# EAGLE design M623 (EAGLE 6.6.0)
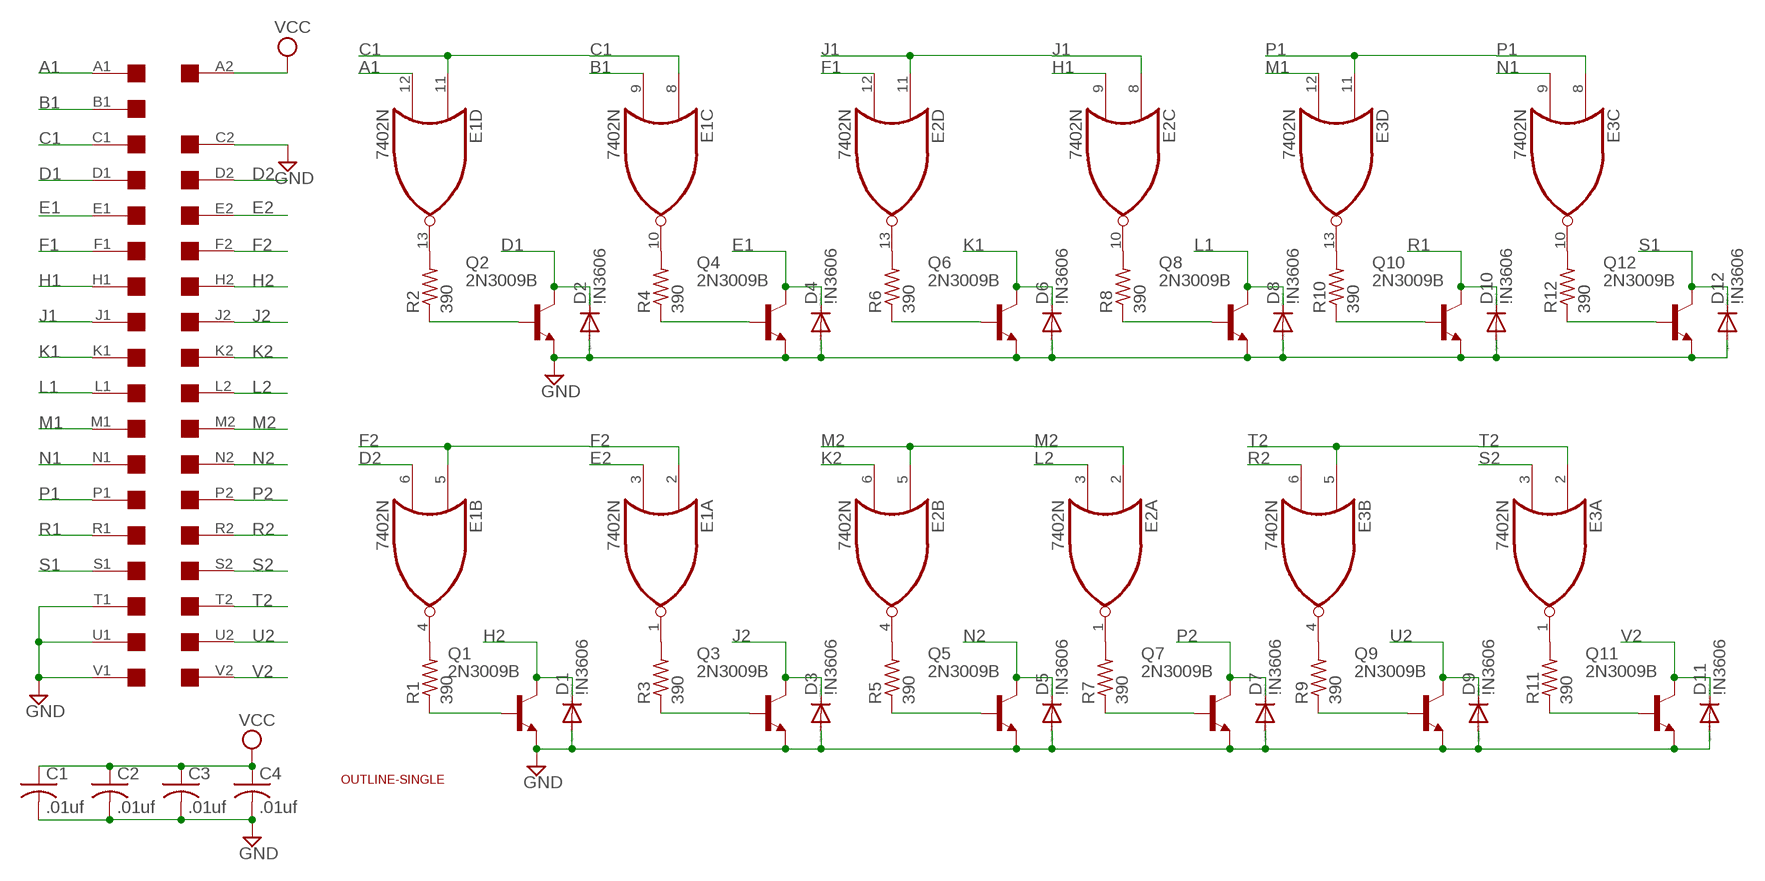
[diagram p0: schematic, sheet 1]

## Parts
C1  .01uf  C-US050-025X075  [C050-025X075]
C2  .01uf  C-US050-025X075  [C050-025X075]
C3  .01uf  C-US050-025X075  [C050-025X075]
C4  .01uf  C-US050-025X075  [C050-025X075]
D1  \!N3606  1N4148DO35-10  [DO35-10]
D2  \!N3606  1N4148DO35-10  [DO35-10]
D3  \!N3606  1N4148DO35-10  [DO35-10]
D4  \!N3606  1N4148DO35-10  [DO35-10]
D5  \!N3606  1N4148DO35-10  [DO35-10]
D6  \!N3606  1N4148DO35-10  [DO35-10]
D7  \!N3606  1N4148DO35-10  [DO35-10]
D8  \!N3606  1N4148DO35-10  [DO35-10]
D9  \!N3606  1N4148DO35-10  [DO35-10]
D10  \!N3606  1N4148DO35-10  [DO35-10]
D11  \!N3606  1N4148DO35-10  [DO35-10]
D12  \!N3606  1N4148DO35-10  [DO35-10]
E1  7402N  [DIL14]
E2  7402N  [DIL14]
E3  7402N  [DIL14]
Q1  2N3009B  2N1613-NPN-TO39-EBC  [TO39]
Q2  2N3009B  2N1613-NPN-TO39-EBC  [TO39]
Q3  2N3009B  2N1613-NPN-TO39-EBC  [TO39]
Q4  2N3009B  2N1613-NPN-TO39-EBC  [TO39]
Q5  2N3009B  2N1613-NPN-TO39-EBC  [TO39]
Q6  2N3009B  2N1613-NPN-TO39-EBC  [TO39]
Q7  2N3009B  2N1613-NPN-TO39-EBC  [TO39]
Q8  2N3009B  2N1613-NPN-TO39-EBC  [TO39]
Q9  2N3009B  2N1613-NPN-TO39-EBC  [TO39]
Q10  2N3009B  2N1613-NPN-TO39-EBC  [TO39]
Q11  2N3009B  2N1613-NPN-TO39-EBC  [TO39]
Q12  2N3009B  2N1613-NPN-TO39-EBC  [TO39]
R1  390  R-US_0207/10  [0207/10]
R2  390  R-US_0207/10  [0207/10]
R3  390  R-US_0207/10  [0207/10]
R4  390  R-US_0207/10  [0207/10]
R5  390  R-US_0207/10  [0207/10]
R6  390  R-US_0207/10  [0207/10]
R7  390  R-US_0207/10  [0207/10]
R8  390  R-US_0207/10  [0207/10]
R9  390  R-US_0207/10  [0207/10]
R10  390  R-US_0207/10  [0207/10]
R11  390  R-US_0207/10  [0207/10]
R12  390  R-US_0207/10  [0207/10]
U$1  OUTLINE-SINGLE  [SINGLE]
U$4  SINGLE  [EDGE-CON2]

## Nets
A1: E1.12(D:I1) U$4.A1
B1: E1.9(C:I1) U$4.B1
C1: E1.8(C:I0) E1.11(D:I0) U$4.C1
D1: D2.C Q2.3(C) U$4.D1
D2: E1.6(B:I1) U$4.D2
E1: D4.C Q4.3(C) U$4.E1
E2: E1.3(A:I1) U$4.E2
F1: E2.12(D:I1) U$4.F1
F2: E1.2(A:I0) E1.5(B:I0) U$4.F2
GND: C1.2 C2.2 C3.2 C4.2 D1.A D2.A D3.A D4.A D5.A D6.A D7.A D8.A D9.A D10.A D11.A D12.A Q1.1(E) Q2.1(E) Q3.1(E) Q4.1(E) Q5.1(E) Q6.1(E) Q7.1(E) Q8.1(E) Q9.1(E) Q10.1(E) Q11.1(E) Q12.1(E) U$4.C2 U$4.T1 U$4.U1 U$4.V1
H1: E2.9(C:I1) U$4.H1
H2: D1.C Q1.3(C) U$4.H2
J1: E2.8(C:I0) E2.11(D:I0) U$4.J1
J2: D3.C Q3.3(C) U$4.J2
K1: D6.C Q6.3(C) U$4.K1
K2: E2.6(B:I1) U$4.K2
L1: D8.C Q8.3(C) U$4.L1
L2: E2.3(A:I1) U$4.L2
M1: E3.12(D:I1) U$4.M1
M2: E2.2(A:I0) E2.5(B:I0) U$4.M2
N1: E3.9(C:I1) U$4.N1
N2: D5.C Q5.3(C) U$4.N2
N$1: E1.13(D:O) R2.2
N$2: Q2.2(B) R2.1
N$3: E1.4(B:O) R1.2
N$4: Q1.2(B) R1.1
N$12: E1.10(C:O) R4.2
N$13: E1.1(A:O) R3.2
N$14: E2.4(B:O) R5.2
N$15: E2.13(D:O) R6.2
N$16: E2.1(A:O) R7.2
N$17: E2.10(C:O) R8.2
N$18: E3.4(B:O) R9.2
N$19: E3.13(D:O) R10.2
N$20: E3.1(A:O) R11.2
N$21: E3.10(C:O) R12.2
N$22: Q12.2(B) R12.1
N$24: Q4.2(B) R4.1
N$25: Q6.2(B) R6.1
N$26: Q8.2(B) R8.1
N$27: Q10.2(B) R10.1
N$28: Q3.2(B) R3.1
N$29: Q5.2(B) R5.1
N$30: Q7.2(B) R7.1
N$31: Q9.2(B) R9.1
N$32: Q11.2(B) R11.1
P1: E3.8(C:I0) E3.11(D:I0) U$4.P1
P2: D7.C Q7.3(C) U$4.P2
R1: D10.C Q10.3(C) U$4.R1
R2: E3.6(B:I1) U$4.R2
S1: D12.C Q12.3(C) U$4.S1
S2: E3.3(A:I1) U$4.S2
T2: E3.2(A:I0) E3.5(B:I0) U$4.T2
U2: D9.C Q9.3(C) U$4.U2
V2: D11.C Q11.3(C) U$4.V2
VCC: C1.1 C2.1 C3.1 C4.1 U$4.A2
Unconnected: U$4.B2

## Power pins joined to a net without a drawn wire
GND: E1.7(P:GND) E2.7(P:GND) E3.7(P:GND)
VCC: E1.14(P:VCC) E2.14(P:VCC) E3.14(P:VCC)

## Library data of the parts
C1-C4 = rcl:C-US: CAPACITOR, American symbol
D1-D12 = diode:1N4148: DIODE high speed (Philips)
E1-E3 = 74xx-us:74*02: Quad 2-input NOR gate
Q1-Q12 = transistor:*-NPN-: NPN Transistror BF959 corrected 2008.03.06
R1-R12 = rcl:R-US_: RESISTOR, American symbol
U$1 = dec-con:OUTLINE-*: Board outlines for DEC boards.
U$4 = dec-con:SINGLE: Single-Height DEC board

## Board
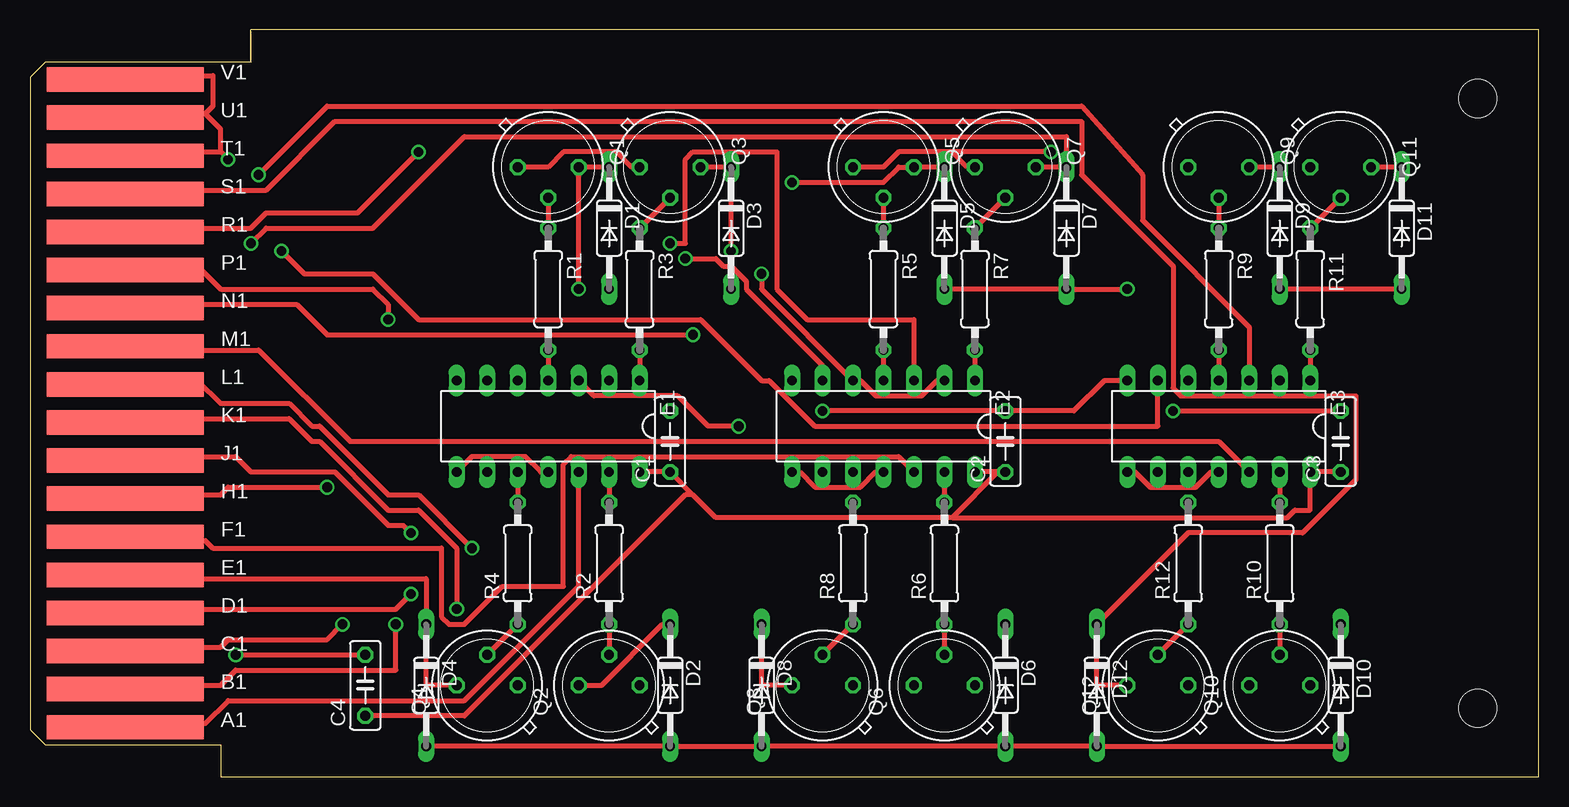
[diagram p1: board, top side]
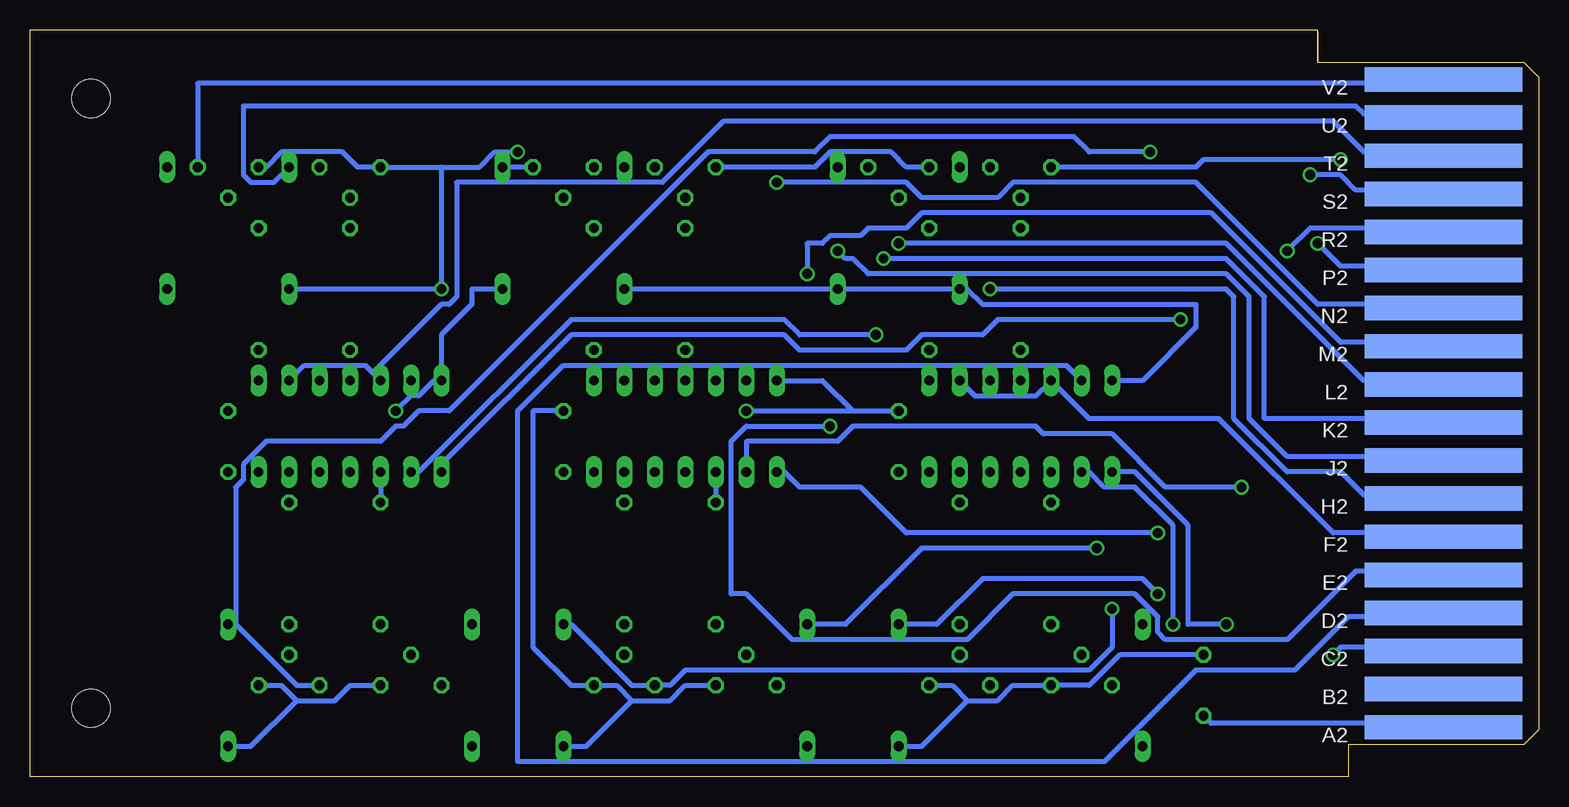
[diagram p2: board, bottom side, seen from below]

Size 125.73 x 62.23 mm. Coordinates in mm from the lower left corner, seen from the top.
Copper layers (1+16): Top 0.035mm / dielectric 1.5mm / Bottom 0.035mm
Design rules "16mils": minimum track width 16mil, minimum drill 32mil, track to track 15mil, track to pad 10mil, pad to pad 10mil, via to via 10mil, smd to smd 10mil, copper to edge 13mil, drill to drill 10mil, minimum pad ring 10mil, minimum via ring 8mil, stop-mask expansion 0mil, vias tented up to drill 0mil, thermal gap 10mil

### Footprints (pad centres in the part's own frame; a part is rotated, then mirrored left to right if it is on the bottom)
C050-025X075 = drill 0.813 octagon: 1 -2.54,0; 2 2.54,0
DO35-10 = drill 0.813 long: A 5.08,0; C -5.08,0
DIL14 = drill 0.813 long: 1 -7.62,-3.81; 2 -5.08,-3.81; 3 -2.54,-3.81; 4 0,-3.81; 5 2.54,-3.81; 6 5.08,-3.81; 7 7.62,-3.81; 8 7.62,3.81; 9 5.08,3.81; 10 2.54,3.81; 11 0,3.81; 12 -2.54,3.81; 13 -5.08,3.81; 14 -7.62,3.81
TO39 = drill 0.813 octagon: 1 0,-2.54; 2 2.54,0; 3 0,2.54
0207/10 = drill 0.813 octagon: 1 -5.08,0; 2 5.08,0
SINGLE = hole 3.175: 120.65,56.515; 120.65,5.715
EDGE-CON2 = smd 13.106 x 2.032: A1 7.938,4.128; B1 7.938,7.303; C1 7.938,10.477; D1 7.938,13.652; E1 7.938,16.828; F1 7.938,20.003; H1 7.938,23.177; J1 7.938,26.352; K1 7.938,29.527; L1 7.938,32.703; M1 7.938,35.877; N1 7.938,39.053; P1 7.938,42.227; R1 7.938,45.403; S1 7.938,48.578; T1 7.938,51.752; U1 7.938,54.928; V1 7.938,58.102 | smd 13.106 x 2.032 bottom: A2 7.938,4.128; B2 7.938,7.303; C2 7.938,10.477; D2 7.938,13.652; E2 7.938,16.828; F2 7.938,20.003; H2 7.938,23.177; J2 7.938,26.352; K2 7.938,29.527; L2 7.938,32.703; M2 7.938,35.877; N2 7.938,39.053; P2 7.938,42.227; R2 7.938,45.403; S2 7.938,48.578; T2 7.938,51.752; U2 7.938,54.928; V2 7.938,58.102

### Placement (x,y rotation side)
C1  53.34,27.94 90 top
C2  81.28,27.94 90 top
C3  109.22,27.94 90 top
C4  27.94,7.62 90 top
D1  48.26,45.72 270 top
D2  53.34,7.62 270 top
D3  58.42,45.72 270 top
D4  33.02,7.62 270 top
D5  76.2,45.72 270 top
D6  81.28,7.62 270 top
D7  86.36,45.72 270 top
D8  60.96,7.62 270 top
D9  104.14,45.72 270 top
D10  109.22,7.62 270 top
D11  114.3,45.72 270 top
D12  88.9,7.62 270 top
E1  43.18,29.21 180 top
E2  71.12,29.21 180 top
E3  99.06,29.21 180 top
Q1  43.18,50.8 270 top
Q2  48.26,7.62 90 top
Q3  53.34,50.8 270 top
Q4  38.1,7.62 90 top
Q5  71.12,50.8 270 top
Q6  76.2,7.62 90 top
Q7  81.28,50.8 270 top
Q8  66.04,7.62 90 top
Q9  99.06,50.8 270 top
Q10  104.14,7.62 90 top
Q11  109.22,50.8 270 top
Q12  93.98,7.62 90 top
R1  43.18,40.64 270 top
R2  48.26,17.78 90 top
R3  50.8,40.64 270 top
R4  40.64,17.78 90 top
R5  71.12,40.64 270 top
R6  76.2,17.78 90 top
R7  78.74,40.64 270 top
R8  68.58,17.78 90 top
R9  99.06,40.64 270 top
R10  104.14,17.78 90 top
R11  106.68,40.64 270 top
R12  96.52,17.78 90 top
U$1  0,0 0 top
U$4  0,0 0 top

### Tracks (layer width: path | path; a pad name or v marks a point on that pad's centre or on a via)
A1
  Top 0.406: E1.12 45.72,15.88 36.2,6.35 16.51,6.35 14.61,4.45 8.26,4.45 U$4.A1
B1  (via drill 0.81)
  Top 0.406: v30.48,12.7 30.48,8.89 17.15,8.89 15.88,7.62 8.26,7.62 U$4.B1
  Bottom 0.406: E1.9 37.47,25.4 36.2,24.13 33.66,24.13 30.48,20.95 v30.48,12.7
C1  (via drill 0.81)
  Top 0.406: E1.8 36.83,26.67 41.28,26.67 42.55,25.4 E1.11 | v26.04,12.7 24.77,11.43 16.51,11.43 15.88,10.79 8.26,10.79 U$4.C1
  Bottom 0.406: E1.8 33.66,25.4 29.21,20.95 29.21,12.7 v26.04,12.7
D1  (via drill 0.81)
  Top 0.406: D2.C 52.71,12.7 47.63,7.62 Q2.3 | v31.75,15.24 30.48,13.97 8.26,13.97 U$4.D1
  Bottom 0.406: D2.C 50.17,12.7 46.36,16.51 33.02,16.51 v31.75,15.24
D2
  Bottom 0.406: E1.6 39.37,34.29 81.28,34.29 85.09,30.48 85.09,1.27 36.2,1.27 28.58,8.89 20.32,8.89 15.88,13.34 8.26,13.34 U$4.D2
E1
  Top 0.406: Q4.3 33.02,7.62 D4.C 33.02,16.51 8.26,16.51 U$4.E1
E2  (via drill 0.81)
  Top 0.406: E1.3 46.99,31.75 53.98,31.75 56.52,29.21 v59.06,29.21
  Bottom 0.406: v59.06,29.21 66.04,29.21 67.31,27.94 67.31,15.24 66.04,15.24 62.23,11.43 47.63,11.43 43.82,15.24 33.66,15.24 31.75,13.34 31.75,12.06 31.12,11.43 20.96,11.43 15.24,17.14 8.26,17.14 U$4.E2
F1
  Top 0.406: E2.12 72.39,26.67 45.09,26.67 44.45,26.04 44.45,15.88 39.37,15.88 36.2,12.7 34.93,12.7 34.29,13.34 34.29,19.05 15.24,19.05 14.61,19.68 8.26,19.68 U$4.F1
F2
  Bottom 0.406: E1.2 46.99,31.75 41.91,31.75 E1.5 37.47,29.84 26.67,29.84 17.15,20.32 8.26,20.32 U$4.F2
GND  (via drill 0.81)
  Top 0.406: v17.15,10.16 C4.2 | D4.A D2.A D8.A D6.A D12.A D10.A | E3.7 89.54,33.02 87,30.48 C2.2 v66.04,30.48 | v95.25,30.48 C3.2 | D11.A D9.A | D5.A D7.A v91.44,40.64 | Q5.1 71.12,50.8 72.39,52.07 76.84,52.07 | 76.84,52.07 78.11,50.8 Q7.1 | v85.09,52.07 76.84,52.07 | 14.61,55.24 8.26,55.24 U$4.U1 | 14.61,55.24 15.24,55.88 15.24,58.42 8.26,58.42 U$4.V1 | Q1.1 43.18,50.8 44.45,52.07 48.9,52.07 50.17,50.8 Q3.1 | 15.88,52.07 v16.51,51.44 | 15.88,52.07 8.26,52.07 U$4.T1 | 14.61,55.24 15.88,53.98 15.88,52.07
  Bottom 0.406: 47.63,6.35 45.09,6.35 43.82,7.62 Q4.1 37.47,7.62 34.93,10.16 C4.2 | 47.63,6.35 48.9,7.62 Q2.1 | v17.15,10.16 16.51,10.79 8.26,10.79 U$4.C2 | Q12.1 99.06,7.62 100.33,6.35 103.51,6.35 | 103.51,6.35 104.78,7.62 Q10.1 | Q8.1 71.12,7.62 72.39,6.35 75.57,6.35 | 75.57,6.35 76.84,7.62 Q6.1 80.65,7.62 83.82,10.79 83.82,30.48 C2.2 | 75.57,6.35 79.38,2.54 D6.A | 103.51,6.35 107.32,2.54 D10.A | 47.63,6.35 51.44,2.54 D2.A | 57.15,30.48 C1.2 | 57.15,30.48 59.69,33.02 E2.7 | v95.25,30.48 93.98,31.75 93.35,31.75 92.08,33.02 E3.7 91.44,36.83 88.9,39.37 88.9,40.64 D7.A | v66.04,30.48 57.15,30.48 | E1.7 33.02,33.02 28.58,37.47 28.58,39.37 46.36,39.37 47.63,40.64 D1.A D3.A D5.A | D9.A v91.44,40.64 91.44,50.8 | Q11.1 106.05,50.8 104.78,52.07 99.7,52.07 98.43,50.8 Q9.1 91.44,50.8 | v85.09,52.07 87,52.07 88.27,50.8 91.44,50.8 | Q1.1 28.58,50.8 27.94,51.44 v16.51,51.44 | Q5.1 60.33,50.8 59.06,52.07 53.98,52.07 52.71,50.8 Q3.1
H1  (via drill 0.81)
  Top 0.406: v24.77,24.13 16.51,24.13 15.88,23.5 8.26,23.5 U$4.H1
  Bottom 0.406: E2.9 66.04,27.94 58.42,27.94 57.15,29.21 41.91,29.21 41.28,28.57 35.56,28.57 31.12,24.13 v24.77,24.13
H2  (via drill 0.81)
  Top 0.406: D1.C Q1.3 v45.72,40.64
  Bottom 0.406: v45.72,40.64 26.04,40.64 25.4,40.01 25.4,29.84 20.96,25.4 16.51,25.4 14.61,23.5 8.26,23.5 U$4.H2
J1  (via drill 0.81)
  Top 0.406: E2.11 70.49,25.4 69.22,24.13 65.41,24.13 64.14,25.4 E2.8 | v31.75,20.32 31.12,20.95 29.85,20.95 25.4,25.4 18.42,25.4 17.15,26.67 8.26,26.67 U$4.J1
  Bottom 0.406: E2.8 62.87,25.4 61.6,24.13 56.52,24.13 52.71,20.32 v31.75,20.32
J2  (via drill 0.81)
  Top 0.406: Q3.3 D3.C v58.42,43.81
  Bottom 0.406: v58.42,43.81 57.79,43.18 57.15,43.18 55.88,41.91 26.04,41.91 24.13,40.01 24.13,29.84 20.96,26.67 8.26,26.67 U$4.J2
K1  (via drill 0.81)
  Top 0.406: v35.56,13.97 35.56,19.05 32.39,22.23 29.85,22.23 24.13,27.94 23.5,27.94 21.59,29.84 8.26,29.84 U$4.K1
  Bottom 0.406: D6.C 80.65,12.7 75.57,7.62 Q6.3 72.39,7.62 71.12,8.89 37.47,8.89 35.56,10.79 v35.56,13.97
K2  (via drill 0.81)
  Top 0.406: E2.6 66.04,34.29 59.69,40.64 59.69,41.27 58.42,42.55 57.79,42.55 57.15,43.18 v54.61,43.18
  Bottom 0.406: v54.61,43.18 26.04,43.18 22.86,40.01 22.86,29.84 8.26,29.84 U$4.K2
L1  (via drill 0.81)
  Top 0.406: D8.C 60.96,7.62 Q8.3 | v36.83,19.05 32.39,23.5 29.85,23.5 24.13,29.21 23.5,29.21 21.59,31.11 15.88,31.11 13.97,33.02 8.26,33.02 U$4.L1
  Bottom 0.406: D8.C 57.79,12.7 51.44,19.05 v36.83,19.05
L2  (via drill 0.81)
  Top 0.406: E2.3 73.66,38.1 64.77,38.1 62.23,40.64 62.23,52.07 55.25,52.07 54.61,51.44 54.61,44.45 v53.34,44.45
  Bottom 0.406: v53.34,44.45 26.04,44.45 14.61,33.02 8.26,33.02 U$4.L2
M1
  Top 0.406: E3.12 99.06,27.94 26.67,27.94 19.05,35.56 8.26,35.56 U$4.M1
M2  (via drill 0.81)
  Top 0.406: E2.2 75.57,33.02 74.3,31.75 70.49,31.75 69.22,33.02 E2.5 60.96,40.64 v60.96,41.91
  Bottom 0.406: v60.96,41.91 60.96,44.45 59.69,44.45 59.06,45.09 56.52,45.09 55.88,45.72 52.71,45.72 51.44,46.99 27.31,46.99 16.51,36.2 8.26,36.2 U$4.M2
N1  (via drill 0.81)
  Top 0.406: v55.25,36.83 24.77,36.83 22.23,39.37 8.26,39.37 U$4.N1
  Bottom 0.406: E3.9 93.35,25.4 80.65,38.1 62.87,38.1 61.6,36.83 v55.25,36.83
N2  (via drill 0.81)
  Top 0.406: D5.C Q5.3 72.39,50.8 71.12,49.53 v63.5,49.53
  Bottom 0.406: v63.5,49.53 52.71,49.53 51.44,48.26 45.09,48.26 43.82,49.53 28.58,49.53 18.42,39.37 8.26,39.37 U$4.N2
N$1
  Top 0.406: E1.13 R2.2
N$2
  Top 0.406: R2.1 Q2.2
N$3
  Top 0.406: R1.2 E1.4
N$4
  Top 0.406: Q1.2 R1.1
N$12
  Top 0.406: E1.10 R4.2
N$13
  Top 0.406: R3.2 E1.1
N$14
  Top 0.406: R5.2 E2.4
N$15
  Top 0.406: E2.13 R6.2
N$16
  Top 0.406: R7.2 E2.1
N$17
  Bottom 0.406: E2.10 R8.2
N$18
  Top 0.406: R9.2 E3.4
N$19
  Top 0.406: E3.13 R10.2
N$20
  Top 0.406: R11.2 E3.1
N$21
  Bottom 0.406: E3.10 R12.2
N$22
  Top 0.406: R12.1 Q12.2
N$24
  Top 0.406: R4.1 Q4.2
N$25
  Top 0.406: R6.1 Q6.2
N$26
  Top 0.406: R8.1 Q8.2
N$27
  Top 0.406: R10.1 Q10.2
N$28
  Top 0.406: Q3.2 R3.1
N$29
  Top 0.406: Q5.2 R5.1
N$30
  Top 0.406: Q7.2 R7.1
N$31
  Top 0.406: Q9.2 R9.1
N$32
  Top 0.406: Q11.2 R11.1
P1  (via drill 0.81)
  Top 0.406: E3.11 98.43,25.4 97.16,24.13 93.35,24.13 92.08,25.4 E3.8 | v29.85,38.1 29.85,39.37 28.58,40.64 15.88,40.64 13.97,42.55 8.26,42.55 U$4.P1
  Bottom 0.406: E3.8 91.44,26.04 80.65,36.83 62.87,36.83 61.6,35.56 52.71,35.56 51.44,36.83 46.36,36.83 45.09,38.1 v29.85,38.1
P2  (via drill 0.81)
  Top 0.406: Q7.3 85.73,50.8 86.36,51.44 86.36,53.34 36.2,53.34 28.58,45.72 19.69,45.72 v18.42,44.45
  Bottom 0.406: Q7.3 D7.C | v18.42,44.45 16.51,42.55 8.26,42.55 U$4.P2
R1  (via drill 0.81)
  Top 0.406: v32.39,52.07 27.31,46.99 19.69,46.99 18.42,45.72 8.26,45.72 U$4.R1
  Bottom 0.406: Q10.3 103.51,7.62 108.59,12.7 | 108.59,12.7 108.59,24.13 107.95,24.77 107.95,26.04 106.05,27.94 96.52,27.94 95.25,29.21 94.62,29.21 93.35,30.48 90.81,30.48 69.22,52.07 60.33,52.07 59.06,53.34 38.74,53.34 37.47,52.07 v32.39,52.07 | 108.59,12.7 D10.C
R2  (via drill 0.81)
  Top 0.406: E3.6 93.98,29.21 65.41,29.21 61.6,33.02 60.96,33.02 55.88,38.1 32.39,38.1 28.58,41.91 22.86,41.91 v20.96,43.81
  Bottom 0.406: v20.96,43.81 19.05,45.72 8.26,45.72 U$4.R2
S1
  Top 0.406: Q12.3 88.9,7.62 D12.C 96.52,20.32 106.05,20.32 110.49,24.77 110.49,31.75 95.89,31.75 95.25,32.38 95.25,42.55 87.63,50.16 87.63,54.61 25.4,54.61 19.69,48.9 8.26,48.9 U$4.S1
S2  (via drill 0.81)
  Top 0.406: E3.3 101.6,37.47 92.71,46.35 92.71,50.16 87.63,55.88 24.77,55.88 v19.05,50.16
  Bottom 0.406: v19.05,50.16 16.51,50.16 15.24,48.9 8.26,48.9 U$4.S2
T2
  Bottom 0.406: 97.16,33.66 97.79,34.29 102.87,34.29 E3.2 | 97.16,33.66 E3.5 | 97.16,33.66 91.44,39.37 90.81,39.37 90.17,40.01 90.17,49.53 73.03,49.53 67.95,54.61 17.15,54.61 14.61,52.07 8.26,52.07 U$4.T2
U2
  Top 0.406: D9.C Q9.3
  Bottom 0.406: D9.C 105.41,49.53 107.32,49.53 107.95,50.16 107.95,55.88 15.24,55.88 14.61,55.24 8.26,55.24 U$4.U2
V2
  Top 0.406: D11.C Q11.3
  Bottom 0.406: Q11.3 111.76,57.78 8.26,57.78 U$4.V2
VCC
  Top 0.406: C3.1 E3.14 106.68,22.23 105.41,22.23 104.78,21.59 76.84,21.59 | E1.14 C1.1 55.25,23.5 | 80.65,25.4 E2.14 | 55.25,23.5 57.15,21.59 76.84,21.59 | 80.65,25.4 76.84,21.59 | 80.65,25.4 C2.1 | C4.1 36.2,5.08 54.61,23.5 55.25,23.5
  Bottom 0.406: C4.1 27.31,4.45 8.26,4.45 U$4.A2